# EAGLE design pvbconnector (EAGLE 9.6.2)
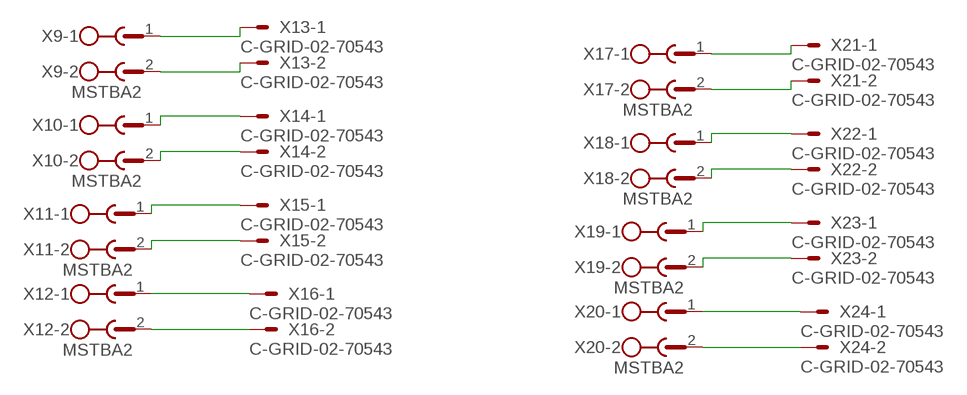
[diagram p0: schematic, sheet 1]

## Parts
X9  MSTBA2  [MSTBA2]
X10  MSTBA2  [MSTBA2]
X11  MSTBA2  [MSTBA2]
X12  MSTBA2  [MSTBA2]
X13  C-GRID-02-70543  [70543-02]
X14  C-GRID-02-70543  [70543-02]
X15  C-GRID-02-70543  [70543-02]
X16  C-GRID-02-70543  [70543-02]
X17  MSTBA2  [MSTBA2]
X18  MSTBA2  [MSTBA2]
X19  MSTBA2  [MSTBA2]
X20  MSTBA2  [MSTBA2]
X21  C-GRID-02-70543  [70543-02]
X22  C-GRID-02-70543  [70543-02]
X23  C-GRID-02-70543  [70543-02]
X24  C-GRID-02-70543  [70543-02]

## Nets
N$15: X9.1 X13.1
N$16: X9.2 X13.2
N$17: X10.1 X14.1
N$18: X10.2 X14.2
N$19: X11.1 X15.1
N$20: X11.2 X15.2
N$21: X12.1 X16.1
N$22: X12.2 X16.2
N$23: X17.1 X21.1
N$24: X17.2 X21.2
N$25: X18.1 X22.1
N$26: X18.2 X22.2
N$27: X19.1 X23.1
N$28: X19.2 X23.2
N$29: X20.1 X24.1
N$30: X20.2 X24.2

## Library data of the parts
X9-X12 X17-X20 = con-phoenix-508:MSTBA2: PHOENIX; MF: FARNELL; MPN: 1757242; OC_FARNELL: 3705171; OC_NEWARK: 71C4161
X13-X16 X21-X24 = con-molex:C-GRID-02: CONNECTOR wire to board 2.54 mm (0.100") pitch header; MF: MOLEX; OC_FARNELL: unknown; OC_NEWARK: unknown

## Board
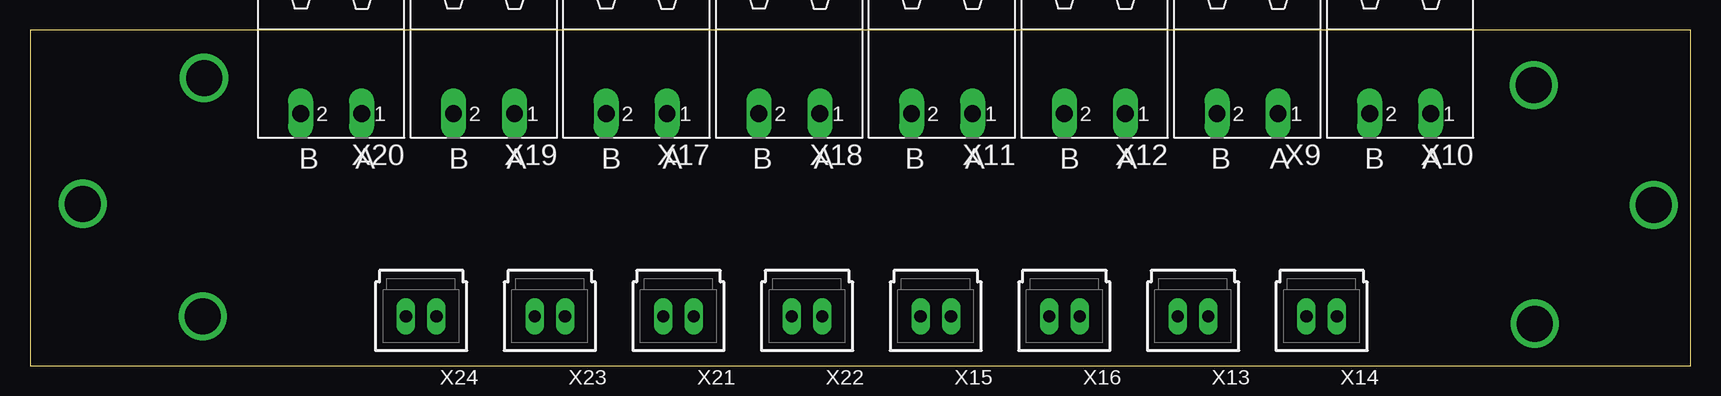
[diagram p1: board, top side]
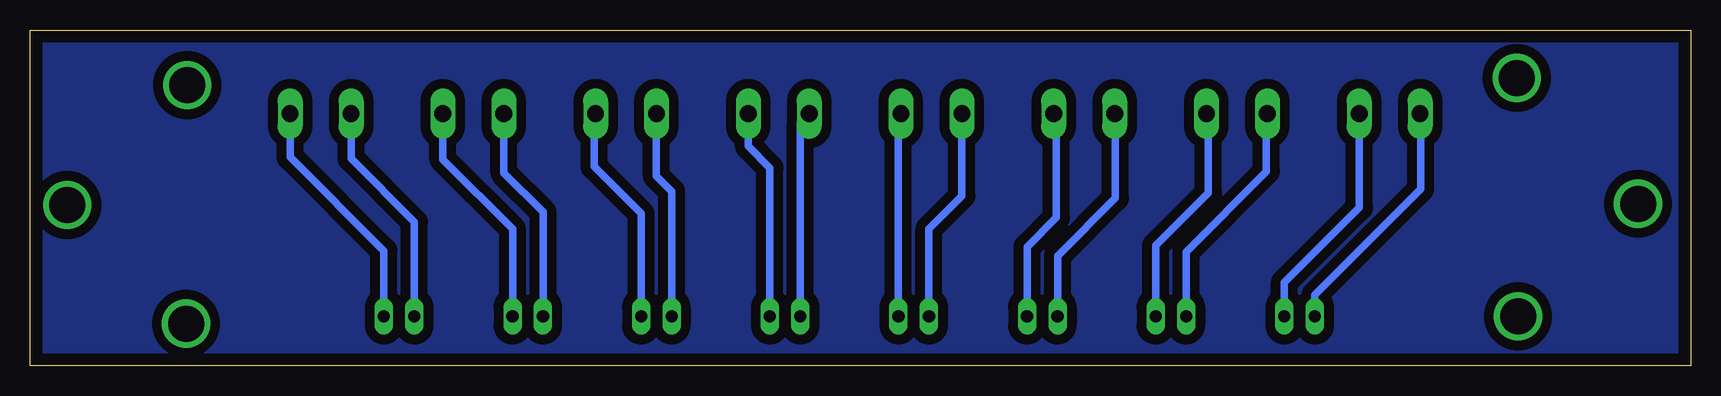
[diagram p2: board, bottom side, seen from below]

Size 138.4 x 28 mm. Coordinates in mm from the lower left corner, seen from the top.
Outline: 0,0 138.4,0 138.4,28 0,28 0,0
Copper layers (1*16): Top 0.035mm / dielectric 1.5mm / Bottom 0.035mm
Design rules "default": minimum track width 6mil, minimum drill 0.35mm, track to track 6mil, track to pad 6mil, pad to pad 6mil, via to via 6mil, smd to smd 6mil, copper to edge 40mil, drill to drill 6mil, minimum pad ring 10mil, minimum via ring 8mil, stop-mask expansion 4mil, vias tented up to drill 0mil, thermal gap 10mil

### Footprints (pad centres in the part's own frame; a part is rotated, then mirrored left to right if it is on the bottom)
MSTBA2 = drill 1.397 long: 1 -2.54,5.08; 2 2.54,5.08
70543-02 = drill 1.016 long: 1 -1.27,0; 2 1.27,0

### Placement (x,y rotation side)
X9  101.46,26.1 180 top
X10  114.18,26.1 180 top
X11  76.01,26.1 180 top
X12  88.73,26.1 180 top
X13  96.92,4.11 180 top
X14  107.64,4.11 180 top
X15  75.48,4.11 180 top
X16  86.2,4.11 180 top
X17  50.55,26.1 180 top
X18  63.28,26.1 180 top
X19  37.83,26.1 180 top
X20  25.1,26.1 180 top
X21  54.04,4.11 180 top
X22  64.76,4.11 180 top
X23  43.32,4.11 180 top
X24  32.6,4.11 180 top

### Tracks (layer width: path | path; a pad name or v marks a point on that pad's centre or on a via)
N$9
  pour Bottom (isolate 0.813): 0,28 138.4,28 138.4,0 0,0
N$12  (via drill 3)
  other vias: 125.3,23.4
N$13  (via drill 3)
  other vias: 125.4,3.5
N$14  (via drill 3)
  other vias: 135.3,13.4
N$15
  Bottom 0.61: X13.1 98.19,11.38 104,17.19 X9.1
N$16
  Bottom 0.61: X13.2 95.65,12.81 98.92,16.07 X9.2
N$17
  Bottom 0.61: X14.1 108.91,9.56 116.72,17.38 X10.1
  Bottom 0.813: X10.1 117.07,21.02
N$18
  Bottom 0.61: X14.2 106.37,11.98 111.64,17.25 X10.2
N$19
  Bottom 0.61: X15.1 76.75,16.5 78.55,18.29 X11.1
N$20
  Bottom 0.61: X15.2 74.21,20.28 X11.2
N$21
  Bottom 0.61: X16.1 87.47,12.67 91.39,16.59 91.39,20.9 X12.1
N$22
  Bottom 0.61: X16.2 84.93,14.54 86.19,15.8 X12.2
  Bottom 0.813: 86.4,20.81 X12.2
N$23
  Bottom 0.61: X21.1 55.31,9.9 52.87,12.34 52.87,20.8 X17.1
N$24
  Bottom 0.61: X21.2 52.77,9.16 47.95,13.97 47.95,20.96 X17.2
N$25
  Bottom 0.61: X22.1 66.03,20.81 X18.1
N$26
  Bottom 0.61: X22.2 63.49,11.4 60.74,14.15 X18.2
N$27
  Bottom 0.61: X23.1 44.59,10.02 40.21,14.4 40.21,20.86 X19.1
N$28
  Bottom 0.61: X23.2 42.05,9.5 35.36,16.19 35.36,20.94 X19.2
N$29
  Bottom 0.61: X24.1 33.87,6.94 27.62,13.19 27.62,21 X20.1
  Bottom 0.813: 27.64,19.71 X20.1
N$30
  Bottom 0.61: X24.2 31.33,5.91 22.51,14.73 22.51,20.97 X20.2
  Bottom 0.813: 22.56,20.01 X20.2
N$31  (via drill 3)
  other vias: 14.5,24
N$32  (via drill 3)
  other vias: 14.4,4.1
N$33  (via drill 3)
  other vias: 4.4,13.5

### Text on the board
tPlace: B | A | B | A | B | A | B | A | B | A | B | A | B | A | B | A